# Altium schematic sheet Battlebot_Controller.SchDoc
size A; SheetNumber: 1; SheetTotal: 1
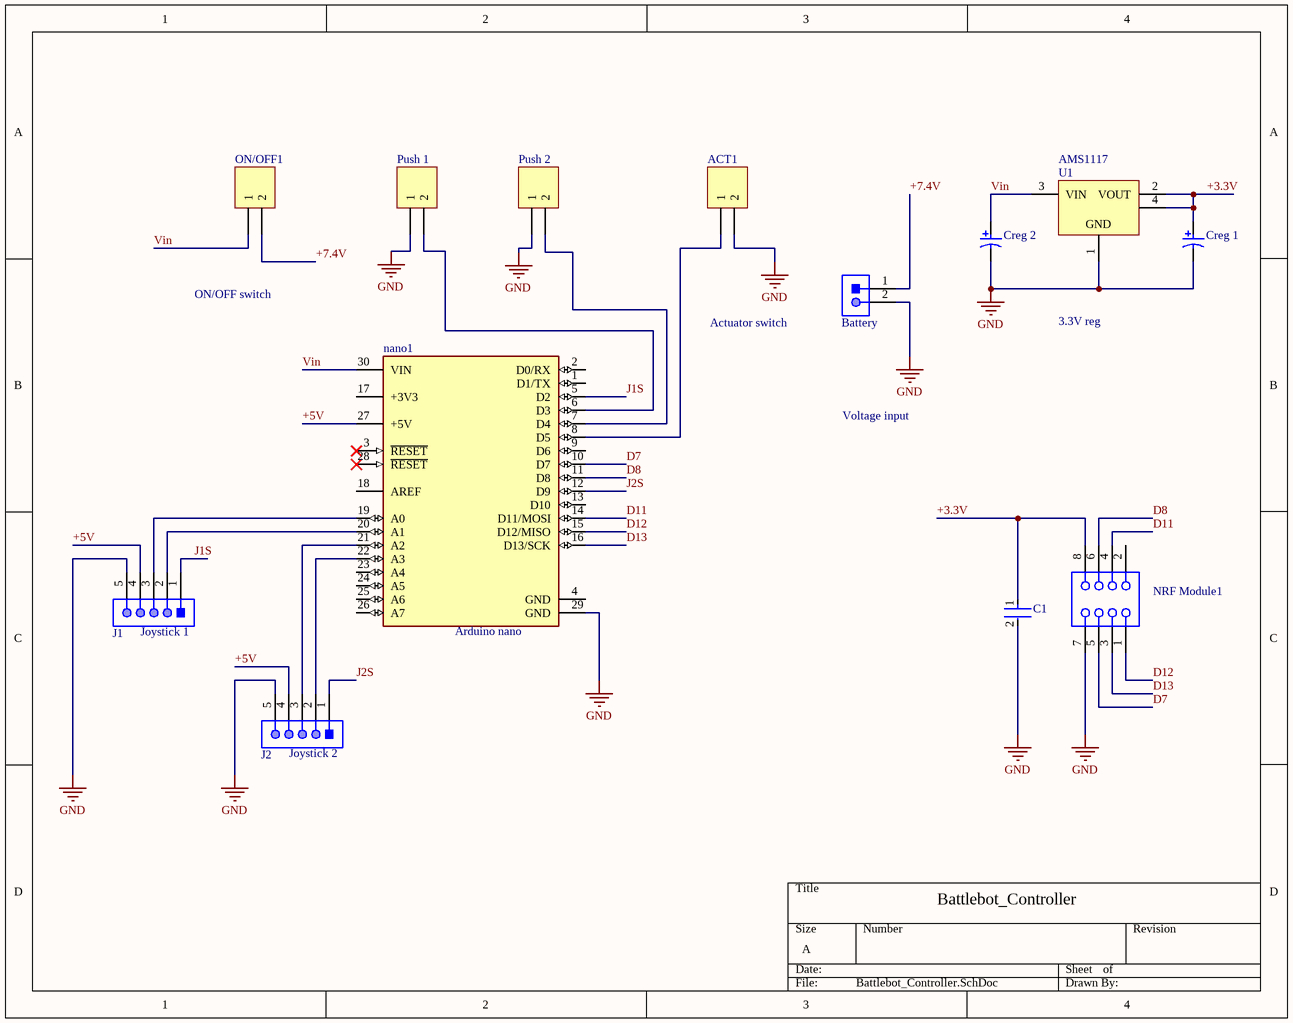
[diagram p0: Battlebot_Controller.SchDoc]

## Parts
ACT1  Header 2  [MY_6410-02]  (value not drawn)
Battery  61300211121  [61300211121]  (value not drawn)
C1  RCER71H106MWK1H03B  [FP-RCEWM1-MFG]  (value not drawn)
Creg_1  ECA1HM100  [CAPPR55-200-1100X500X1200]  (value not drawn)
Creg_2  ECA1HM100  [CAPPR55-200-1100X500X1200]  (value not drawn)
J1  61300511021  [61300511021]  (value not drawn)
J2  61300511021  [61300511021]  (value not drawn)
nano1  A000005  [FP-A000005-MFG]  (value not drawn)
NRF_Module1  SSW-104-02-G-D  [SMTC-SSW-104-02-X-D]  (value not drawn)
ON/OFF1  Header 2  [MY_6410-02]  (value not drawn)
Push_1  Header 2  [MY_6410-02]  (value not drawn)
Push_2  Header 2  [MY_6410-02]  (value not drawn)
U1  AMS1117  [DCY0004A_M]

## Nets
GND: ACT1.2 Battery.2 C1.2 Creg_1.2 Creg_2.2 J1.5 J2.5 nano1.29(GND) NRF_Module1.7 Push_1.1 Push_2.1 U1.1(GND)
+3.3V: C1.1 Creg_1.1 NRF_Module1.8 U1.2(VOUT) U1.4(VOUT)
+5V: J1.4 J2.4 nano1.27(+5V)
+7.4V: Battery.1 ON/OFF1.2
D7: nano1.10(D7) NRF_Module1.5
D8: nano1.11(D8) NRF_Module1.6
D11: nano1.14(D11/MOSI) NRF_Module1.4
D12: nano1.15(D12/MISO) NRF_Module1.1
D13: nano1.16(D13/SCK) NRF_Module1.3
J1S: J1.1 nano1.5(D2)
J2S: J2.1 nano1.12(D9)
Vin: Creg_2.1 nano1.30(VIN) ON/OFF1.1 U1.3(VIN)
NetACT1_1: ACT1.1 nano1.8(D5)
NetJ1_2: J1.2 nano1.20(A1)
NetJ1_3: J1.3 nano1.19(A0)
NetJ2_2: J2.2 nano1.22(A3)
NetJ2_3: J2.3 nano1.21(A2)
Netnano1_6: nano1.6(D3) Push_1.2
Netnano1_7: nano1.7(D4) Push_2.2

Not connected (* = marked no-connect by the designer): nano1 1(D1/TX) 2(D0/RX) 3(~{RESET})* 4(GND) 9(D6) 13(D10) 17(+3V3) 18(AREF) 23(A4) 24(A5) 25(A6) 26(A7) 28(~{RESET})*; NRF_Module1 2

## Notes on the sheet
- ON/OFF switch
- Actuator switch
- 3.3V reg
- Voltage input
- (near J1) Joystick 1
- (near nano1) Arduino nano
- (near J2) Joystick 2
- Battlebot_Controller

## Library data of the parts
ACT1 ON/OFF1 Push_1 Push_2 = Header 2: Header, 2-Pin; ASiD Part Number: Header 2-AS
Battery = CMP-1712-00002-4: THT Vertical Pin Header WR-PHD, Pitch 2.54 mm, Single Row, 2 pins; Manufacturer: Wurth Elektronik; Rated Current: 3A; Gender: Male; Withstanding Voltage: 500VAC; Working Voltage: 250VAC; Pitch: 2.54mm; Contact Resistance: 20mOhm; Pin Number: 2; Mounting Technology: THT; Orientation: Vertical; Operating Temperature: -40to105degC; Packaging: Bag; Publisher: WurthElektronik; Datasheet URL: https://katalog.we-online.de/em/datasheet/6130xx11121.pdf; Manufacturer URL: http://www.we-online.de; Row Number: Single; Package Reference: 61300211121; Part Number: 61300211121
C1 = CMP-06035-035073-1: Cap Ceramic 10uF 50V X7R ±20% Radial 5mm +125°C Automotive Ammo Pack; Lead/Base Style: Formed Leads; Lead Diameter: 0.5mm; Width: 4mm; Max Operating Temperature: 125°C; Case/Package: Radial; Capacitance: 10uF; Mount: Through Hole; Depth: 7.5mm; Dielectric: X7R; Tolerance: 20%; Length: 5.5mm; Min Operating Temperature: -55°C; Height: 7.5mm; Ratings: AEC-Q200; Voltage Rating: 50V; Lead Pitch: 0.197inch; Diameter: 5.5mm; Height - Seated (Max): 0.295inch; Voltage: 50V; Resistor Type: Ceramic; Voltage Rating (DC): 50V; Package Quantity: 500; Lead Free: Lead Free; Packaging: Bulk; Termination: Radial
Creg_1 Creg_2 = CMP-1665-00038-2: Aluminum Electrolytic Capacitor, 10 uF, +/- 20%, 50 V, -40 to 85 degC, 2-Pin THD, RoHS, Bulk; Manufacturer: Panasonic; Life (Hours): 2000Hour; Lead/Base Style: Straight; Dissipation Factor: 0.12%; Capacitance: 10uF; Leakage Current: 3uA; Dielectric Material: Aluminium; Lead Diameter: 0.5mm; Voltage Rating: 50V; Ripple Current: 65mA; Package Reference: CAPPR55-200-1100X500X1200; Height: 11mm; Diameter: 5mm; REACH SVHC: NoSVHC; Mount: ThroughHole; Packaging: Bulk; Manufacturer URL: http://www.panasonic.com/; Termination: Radial; Datasheet URL: https://industrial.panasonic.com/cdbs/www-data/pdf/RDF0000/ABA0000C1218.pdf; Lead Free: LeadFree; Height - Seated (Max): 0.472inch; Case/Package: Radial; Package Description: 2-Pin Radial Lead, Dia 5 mm, Height 12 mm; Tolerance: 20%; Datasheet Version: Rev. 05, 10/2016; Package Quantity: 200; Ripple Current (AC): 65mA; Min Operating Temperature: -40degC; RoHSCompliant: true; Number of Pins: 2; Max Operating Temperature: 85degC; Voltage: 50V; Lead Pitch: 2mm; Radiation Hardening: No; Voltage Rating (DC): 50V; Length: 11mm
J1 J2 = CMP-1502-01067-1: THT Angled Pin Header WR-PHD, Pitch 2.54 mm, Single Row, 5 pins; Manufacturer: Wurth Elektronik; Working Voltage: 250VAC; Withstanding Voltage: 500VAC; Gender: Male; Contact Resistance: 20mOhm; Rated Current: 3A; Pitch: 2.54mm; Pin Number: 5; Orientation: Angled; Packaging: Bag; Package Reference: 61300511021; Mounting Technology: THT; Publisher: WurthElektronik; Row Number: Single; Operating Temperature: -40to105degC; Part Number: 61300511021; Datasheet URL: https://katalog.we-online.de/em/datasheet/6130xx11021.pdf; Manufacturer URL: http://www.we-online.de
nano1 = CMP-189986-000002-1: ARDUINO NANO ATMEGA328 EVAL BRD; Number of Bits: 8; Evaluation Kit: Yes; Operating Supply Voltage: 12V; Interface: I2C; Data Bus Width: 8b; Core Architecture: AVR; Packaging: Bulk; Length: 7inch; Package Quantity: 50; Width: 5inch; REACH SVHC: No SVHC; Weight: 0.358383oz; Series: AVR® ATmega; Height: 0.25inch
NRF_Module1 = CMP-1023-00343-1: SQ Post Socket, Through-hole, Vertical, -55 to 125 degC, 2.54mm Pitch, 8-Pin, Female, RoHS; Manufacturer: Samtec; Mounting Technology: Through-hole; ComponentLink1Description: Manufacturer URL; Orientation: Vertical; Pitch: 2.54 mm; PartNumber: SSW-104-02-G-D; ComponentLink2URL: http://www.samtec.com/documents/webfiles/pdf/SSW_TH.PDF; PackageReference: SSW-104-02-X-D; ComponentLink3Description: Package Specification; PackageVersion: CA, 6/1987; PackageDescription: Assembly, Socket Strip .016 X .031 Tail; ComponentLink2Description: Datasheet; RoHS: True; ComponentLink1URL: http://www.samtec.com; ComponentLink3URL: http://www.samtec.com/documents/webfiles/cpdf/SSW-1XX-XX-XXX-X-XX-XXX-XX-MKT.pdf; DatasheetVersion: F-214; Temperature Range: -55 to 125 degC
U1 = CMP-019-00021-3: Low-Dropout Linear Regulator, 800 mA, -40 to 125 degC, 4-Pin SOT-223 (DCY), Green (RoHS & no Sb/Br), Tape and Reel; Manufacturer: Texas Instruments; Dropout Voltage: 1.2V; Nominal Output Voltage: 5V; Max Ouput Current: 800mA; Outputs: 1; Min Input Voltage: 2.6V; Max Input Voltage: 15V; Manufacturer URL: http://www.ti.com/; Max Operating Temperature: 125°C; Packaging: TapeandReel; RoHS Compliant: True; Output Voltage: 5V; Pins: 4; Package Description: 4-Pin Small Outline Transistor, Body 6.5 x 3.5 mm, Pitch 2.3 mm; Min Operating Temperature: -40°C; Mounting Technology: SM; Output Current: 800mA; Case/Package: SOT-223; Datasheet Version: SNOS412N, 01/2016; Datasheet URL: http://www.ti.com/lit/ds/symlink/lm1117.pdf; Package Reference: DCY0004A